# Altium schematic sheet 11_sensors.SchDoc: =Proj_Title
size B; Address1: Giesshuebelstrasse 40; Address2: 8045 Zurich, Switzerland; SheetNumber: 11
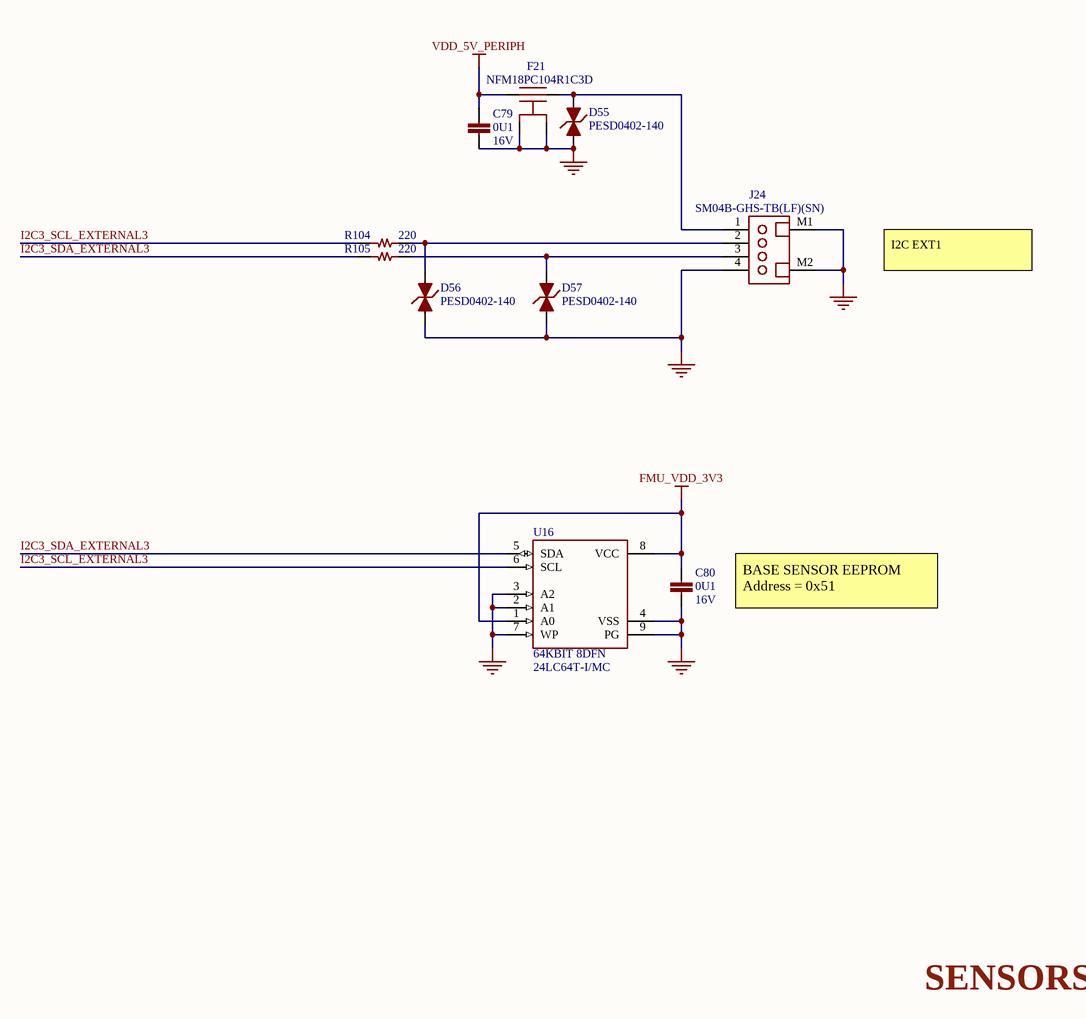
[diagram p0: 11_sensors.SchDoc]

## Parts
C79  value 0U1  Voltage - Rated: 16V  [CAPC100X50X56L25N]  (hidden comment: CAP CER 0.1UF 10% 16V X7R 0402)
C80  value 0U1  Voltage - Rated: 16V  [CAPC100X50X56L25N]  (hidden comment: CAP CER 0.1UF 10% 16V X7R 0402)
D55  Manufacturer Part Number: PESD0402-140  [DIONC100X50X43L20N]  (hidden comment: DIODE TVS BIDIRECTIONAL 14VWM 40VC 0402)
D56  Manufacturer Part Number: PESD0402-140  [DIONC100X50X43L20N]  (hidden comment: DIODE TVS BIDIRECTIONAL 14VWM 40VC 0402)
D57  Manufacturer Part Number: PESD0402-140  [DIONC100X50X43L20N]  (hidden comment: DIODE TVS BIDIRECTIONAL 14VWM 40VC 0402)
F21  Manufacturer Part Number: NFM18PC104R1C3D  [NFM18PC104R1C3_0603_NO_VIA]  (hidden comment: FILTER CAP FEEDTHRU 0.1UF 20% 16V 0603)
J24  Manufacturer Part Number: SM04B-GHS-TB(LF)(SN)  [JST_SM04B-GHS-TBLFSN]  (hidden comment: CONN HEADER GH SIDE 4POS 1.25MM SMT)
R104  value 220  [RESC100X50X40L25]  (hidden comment: RES SMD 220 OHM 1% 1/16W 0402)
R105  value 220  [RESC100X50X40L25]  (hidden comment: RES SMD 220 OHM 1% 1/16W 0402)
U16  ID: 64KBIT 8DFN  Manufacturer Part Number: 24LC64T-I/MC  [SON9P50_200X300X100L40X25T153X170N]  (hidden comment: IC EEPROM 64K I2C 400KHZ 8DFN)

## Nets
FMU_VDD_3V3: C80.1 U16.1(A0) U16.8(VCC)
GND: C79.2 C80.2 D55.1 D56.1 D57.1 F21.2A(GND) F21.2B(GND) J24.4 J24.M1 J24.M2 U16.2(A1) U16.3(A2) U16.4(VSS) U16.7(WP) U16.9(PG)
VDD_5V_PERIPH: C79.1 F21.1
I2C3_SCL_EXTERNAL3: R104.1 U16.6(SCL)
I2C3_SDA_EXTERNAL3: R105.1 U16.5(SDA)
NetD55_2: D55.2 F21.3 J24.1
NetD56_2: D56.2 J24.2 R104.2
NetD57_2: D57.2 J24.3 R105.2

## Notes on the sheet
- I2C EXT1
- BASE SENSOR EEPROM
  Address = 0x51
- SENSORS
- Title
- Size:
- Date:
- B
- Number:
- Sheet
- Rev:
- of
- Author:
- Checked:
- File:

## Library data of the parts
C79 C80 = CAP_0U1_16V_X7R_0402: Manufacturer: Murata Electronics; Manufacturer Part Number: GCM155R71C104KA55J; Packaging: Cut Tape (CT); Part Status: Active; Tolerance: ±10%; Operating Temperature: -55°C ~ 125°C; Supplier 1: Digi-Key; Supplier Part Number 1: 490-7998-1-ND; Category: Capacitors; Stock 1: 6381653; Pricing 1: 1=0.1, 10=0.049, 100=0.022, 500=0.0157, 1000=0.01233, 2500=0.01121, 5000=0.01032 (USD); ComponentLink1Description: https://www.digikey.com/product-detail/en/murata-electronics/GCM155R71C104KA55J/490-7998-1-ND/4380283; ComponentLink1URL: https://www.digikey.com/product-detail/en/murata-electronics/GCM155R71C104KA55J/490-7998-1-ND/4380283
D55-D57 = DIODE_TVS_0402: Manufacturer: Littelfuse Inc.; Packaging: Cut Tape (CT); Part Status: Active; Operating Temperature: -55°C ~ 125°C (TJ); ComponentLink1URL: https://www.digikey.com/products/en/circuit-protection/tvs-diodes/144?k=PESD0402-140&k=&pkeyword=PESD0402-140&pv7=2&sf=0&quantity=&ColumnSort=0&page=1&pageSize=25; ComponentLink1Description: https://www.digikey.com/products/en/circuit-protection/tvs-diodes/144?k=PESD0402-140&k=&pkeyword=PESD0402-140&pv7=2&sf=0&quantity=&ColumnSort=0&page=1&pageSize=25; Supplier 1: Digi-Key; Supplier Part Number 1: PESD0402-140CT-ND; Category: Circuit Protection; Stock 1: 281442; Pricing 1: 10000=0.13154, 30000=0.12096 (USD)
F21 = FILTER_0.1uF_16V_2A_NO_VIA_0603: Manufacturer: Murata Electronics North America; Packaging: Cut Tape (CT); Part Status: Active; Tolerance: ±20%; Voltage - Rated: 16V; Operating Temperature: -55°C ~ 125°C; Supplier 1: Digi-Key; Supplier Part Number 1: 490-6969-1-ND; Category: Filters; Stock 1: 172860; Pricing 1: 1=0.19, 10=0.173, 25=0.1652, 50=0.1598, 100=0.1544, 250=0.1464, 500=0.12246, 1000=0.09503 (USD); ComponentLink1Description: https://www.digikey.com/products/en/filters/feed-through-capacitors/845?k=NFM18PC104R1C3D&k=&pkeyword=NFM18PC104R1C3D&pv7=2&sf=0&quantity=&ColumnSort=0&page=1&pageSize=25; ComponentLink1URL: https://www.digikey.com/products/en/filters/feed-through-capacitors/845?k=NFM18PC104R1C3D&k=&pkeyword=NFM18PC104R1C3D&pv7=2&sf=0&quantity=&ColumnSort=0&page=1&pageSize=25
J24 = CONN_JST_GH_4PIN_RA_SMT: Manufacturer: JST Sales America Inc.; Voltage Rating: 50V; System: Connector; Packaging: Cut Tape (CT); Part Status: Active; Operating Temperature: -25°C ~ 85°C; Supplier 1: Digi-Key; Supplier Part Number 1: 455-1566-1-ND; Category: Connectors, Interconnects; Stock 1: 109892; Pricing 1: 1=0.45, 10=0.423, 100=0.3244, 500=0.28212, 1000=0.23274 (USD); ComponentLink1Description: https://www.digikey.com/products/en/connectors-interconnects/rectangular-connectors-headers-male-pins/314?k=SM04B-GHS-TB%28LF%29%28SN%29-&k=&pkeyword=SM04B-GHS-TB%28LF%29%28SN%29-&pv7=2&sf=0&quantity=&ColumnSort=0&page=1&pageSize=25; ComponentLink1URL: https://www.digikey.com/products/en/connectors-interconnects/rectangular-connectors-headers-male-pins/314?k=SM04B-GHS-TB%28LF%29%28SN%29-&k=&pkeyword=SM04B-GHS-TB%28LF%29%28SN%29-&pv7=2&sf=0&quantity=&ColumnSort=0&page=1&pageSize=25
R104 R105 = RES_220_1%_1/16W_0402: Manufacturer: Yageo; Manufacturer Part Number: RC0402FR-07220RL; Category: Resistors; Packaging: Cut Tape (CT); Part Status: Active; Tolerance: ±1%; Power: 1/16W; Operating Temperature: -55°C ~ 155°C; ComponentLink1URL: https://www.digikey.com/products/en/resistors/chip-resistor-surface-mount/52?k=RC0402FR-07220RL&k=&pkeyword=RC0402FR-07220RL&pv7=2&sf=0&quantity=&ColumnSort=0&page=1&pageSize=25; ComponentLink1Description: https://www.digikey.com/products/en/resistors/chip-resistor-surface-mount/52?k=RC0402FR-07220RL&k=&pkeyword=RC0402FR-07220RL&pv7=2&sf=0&quantity=&ColumnSort=0&page=1&pageSize=25; Supplier 1: Digi-Key; Supplier Part Number 1: 311-220LRCT-ND; Stock 1: 897942; Pricing 1: 1=0.1, 10=0.014, 100=0.0056, 1000=0.00253, 2500=0.0022, 5000=0.00181 (USD)
U16 = IC_EEPROM_64K_I2C_8DFN: Manufacturer: Microchip Technology; Part Status: Active; Operating Temperature: -40°C ~ 85°C (TA); Supplier 1: Digi-Key; Supplier Part Number 1: 24LC64T-I/MCCT-ND; Category: Integrated Circuits (ICs); Stock 1: 2351; Pricing 1: 1=0.47 (USD); Packaging: Cut Tape (CT); ComponentLink1Description: https://www.digikey.com/products/en/integrated-circuits-ics/memory/774?k=&pkeyword=&sv=0&pv7=2&sf=0&FV=fffc0096&mpart=24LC64T-I%2FMC&quantity=&ColumnSort=0&page=1&pageSize=25; ComponentLink1URL: https://www.digikey.com/products/en/integrated-circuits-ics/memory/774?k=&pkeyword=&sv=0&pv7=2&sf=0&FV=fffc0096&mpart=24LC64T-I%2FMC&quantity=&ColumnSort=0&page=1&pageSize=25